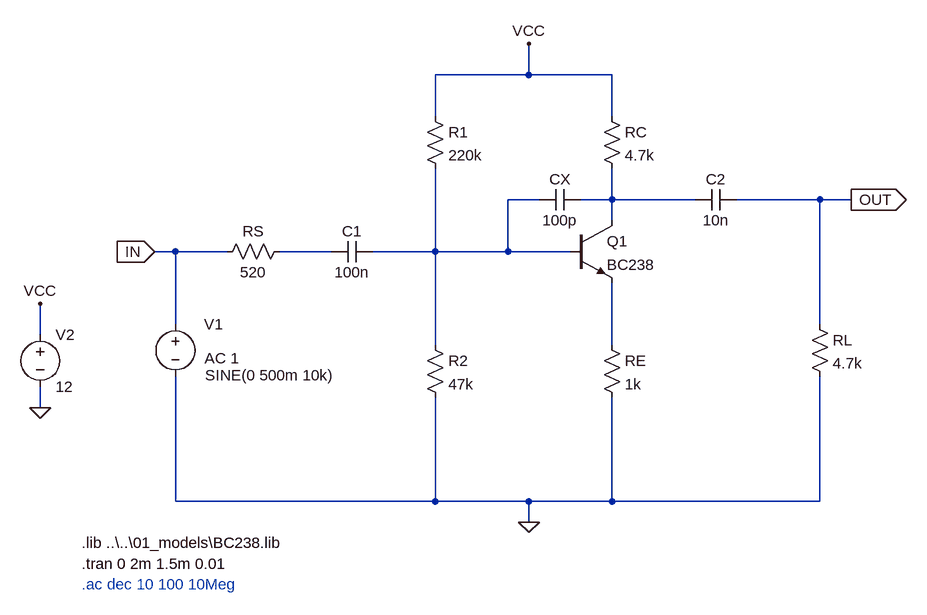
[diagram p0: schematic ce_amplifier.asc]
ce_amplifier.asc, the LTspice schematic file:
Version 4
SHEET 1 1156 688
WIRE 544 -112 544 -160
WIRE 544 -112 400 -112
WIRE 672 -112 544 -112
WIRE 400 -48 400 -112
WIRE 672 -48 672 -112
WIRE 560 80 512 80
WIRE 672 80 672 32
WIRE 672 80 624 80
WIRE 800 80 672 80
WIRE 992 80 864 80
WIRE 1040 80 992 80
WIRE 672 112 672 80
WIRE 0 160 -32 160
WIRE 80 160 0 160
WIRE 240 160 160 160
WIRE 400 160 400 32
WIRE 400 160 304 160
WIRE 512 160 512 80
WIRE 512 160 400 160
WIRE 608 160 512 160
WIRE 0 272 0 160
WIRE 992 272 992 80
WIRE -208 288 -208 240
WIRE 400 304 400 160
WIRE 672 304 672 208
WIRE -208 400 -208 368
WIRE 0 544 0 352
WIRE 400 544 400 384
WIRE 400 544 0 544
WIRE 544 544 400 544
WIRE 672 544 672 384
WIRE 672 544 544 544
WIRE 992 544 992 352
WIRE 992 544 672 544
WIRE 544 576 544 544
FLAG 544 576 0
FLAG -208 400 0
FLAG -208 240 VCC
FLAG 544 -160 VCC
FLAG -32 160 IN
IOPIN -32 160 In
FLAG 1040 80 OUT
IOPIN 1040 80 Out
SYMBOL npn 608 112 R0
SYMATTR InstName Q1
SYMATTR Value BC238
SYMBOL res 656 -64 R0
SYMATTR InstName RC
SYMATTR Value 4.7k
SYMBOL res 656 288 R0
SYMATTR InstName RE
SYMATTR Value 1k
SYMBOL res 976 256 R0
SYMATTR InstName RL
SYMATTR Value 4.7k
SYMBOL res 384 -64 R0
SYMATTR InstName R1
SYMATTR Value 220k
SYMBOL res 384 288 R0
SYMATTR InstName R2
SYMATTR Value 47k
SYMBOL res 176 144 R90
WINDOW 0 0 56 VBottom 2
WINDOW 3 32 56 VTop 2
SYMATTR InstName RS
SYMATTR Value 520
SYMBOL cap 304 144 R90
WINDOW 0 0 32 VBottom 2
WINDOW 3 32 32 VTop 2
SYMATTR InstName C1
SYMATTR Value 100n
SYMBOL cap 624 64 R90
WINDOW 0 0 32 VBottom 2
WINDOW 3 32 32 VTop 2
SYMATTR InstName CX
SYMATTR Value 100p
SYMBOL cap 864 64 R90
WINDOW 0 0 32 VBottom 2
WINDOW 3 32 32 VTop 2
SYMATTR InstName C2
SYMATTR Value 10n
SYMBOL voltage 0 256 R0
WINDOW 3 46 94 Left 2
WINDOW 123 45 68 Left 2
WINDOW 39 0 0 Left 2
WINDOW 0 44 16 Left 2
SYMATTR Value SINE(0 500m 10k)
SYMATTR Value2 AC 1
SYMATTR InstName V1
SYMBOL voltage -208 272 R0
WINDOW 123 0 0 Left 2
WINDOW 39 0 0 Left 2
SYMATTR InstName V2
SYMATTR Value 12
TEXT -144 640 Left 2 !.tran 0 2m 1.5m 0.01
TEXT -144 672 Left 2 ;.ac dec 10 100 10Meg
TEXT -144 608 Left 2 !.lib ..\\..\\01_models\\BC238.lib

The netlist it stands for:
* ce_amplifier.asc
Q1 N002 N001 N004 0 BC238
RC VCC N002 4.7k
RE N004 0 1k
RL OUT 0 4.7k
R1 VCC N001 220k
R2 N001 0 47k
RS N003 IN 520
C1 N001 N003 100n
CX N002 N001 100p
C2 OUT N002 10n
V1 IN 0 SINE(0 500m 10k) AC 1
V2 VCC 0 12
.model NPN NPN
.model PNP PNP
.lib standard.bjt
.tran 0 2m 1.5m 0.01
* .ac dec 10 100 10Meg
.lib ..\..\01_models\BC238.lib
.backanno
.end